# Altium schematic sheet KeyBoard.SchDoc
size A4
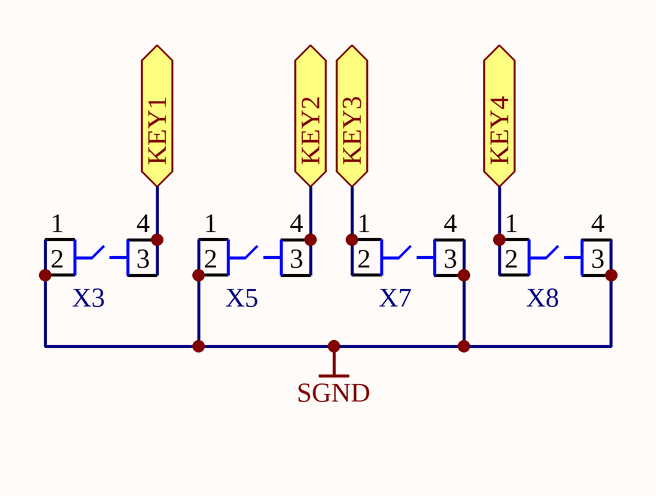
[diagram p0: KeyBoard.SchDoc]

## Parts
X3  TACT0606  [TACT0606]  (value not drawn)
X5  TACT0606  [TACT0606]  (value not drawn)
X7  TACT0606  [TACT0606]  (value not drawn)
X8  TACT0606  [TACT0606]  (value not drawn)

## Ports
KEY1, KEY2, KEY3, KEY4

## Nets
SGND: X3.1 X3.2 X5.1 X5.2 X7.3 X7.4 X8.3 X8.4
KEY1: X3.3 X3.4 ; port KEY1
KEY2: X5.3 X5.4 ; port KEY2
KEY3: X7.1 X7.2 ; port KEY3
KEY4: X8.1 X8.2 ; port KEY4

## Library data of the parts
X3 X5 X7 X8 = TACT0606: Tact switch 6x6mm; Name: TACT0606; Type: Кнопка